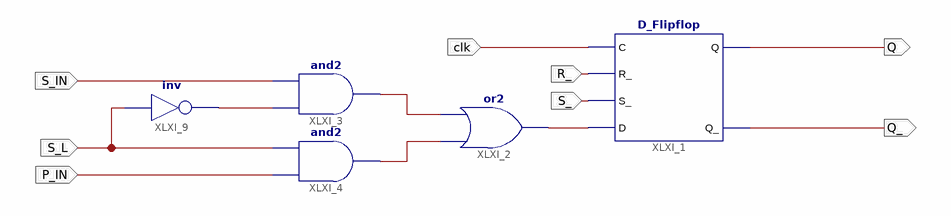
[diagram p0: schematic sheet 1]
// Xilinx ISE schematic ShiftReg1b.sch (kintex7) as structural Verilog: 5 symbols, 8 ports
module ShiftReg1b (
  input  clk,
  input  S_IN,
  input  S_L,
  input  P_IN,
  input  R_,
  input  S_,
  output Q,
  output Q_
);

  wire XLXN_3, XLXN_4, XLXN_5, XLXN_11;

  D_Flipflop XLXI_1 (.C(clk), .R_(R_), .S_(S_), .D(XLXN_3), .Q(Q), .Q_(Q_));
  or XLXI_2 (XLXN_3, XLXN_5, XLXN_4);
  and XLXI_3 (XLXN_4, XLXN_11, S_IN);
  and XLXI_4 (XLXN_5, P_IN, S_L);
  not XLXI_9 (XLXN_11, S_L);
endmodule
